# Altium schematic sheet 9) Connector.SchDoc
size 420 x 297 mm
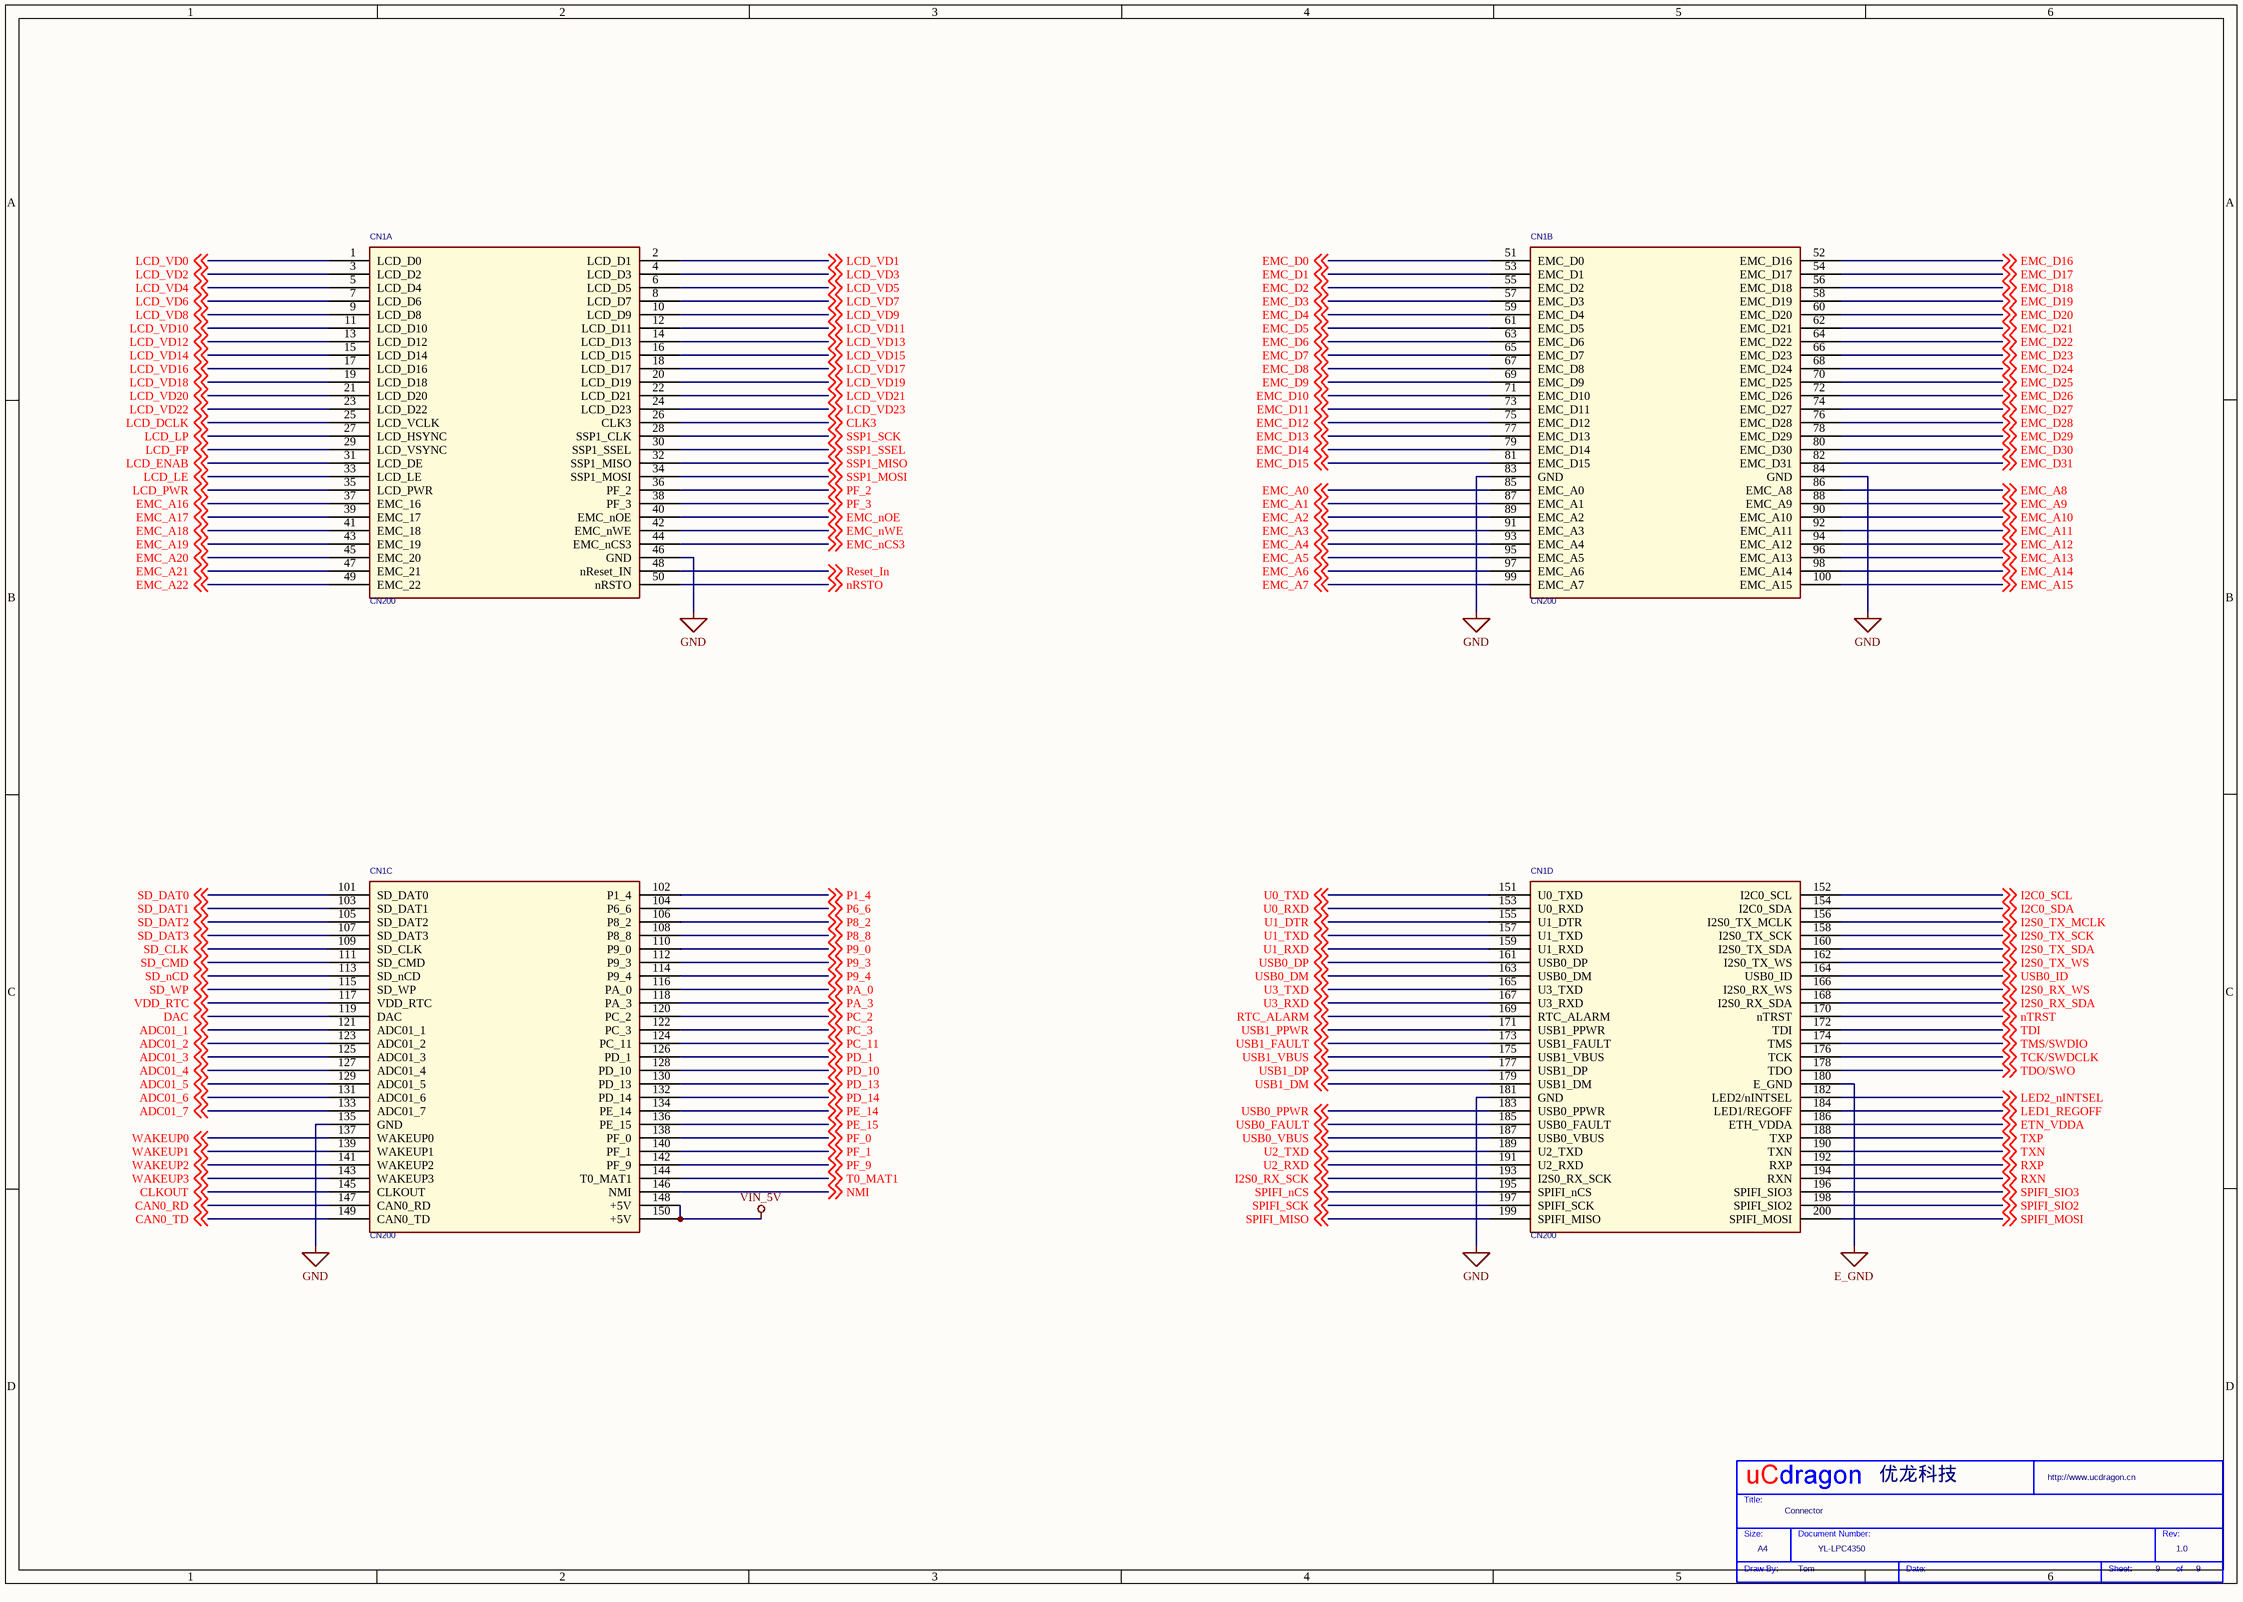
[diagram p0: 9) Connector.SchDoc]

## Parts
*  Company: 优龙科技  Drawing: Tom  Doc: YL-LPC4350  RevCode: 1.0  Title: Connector  Page Size: A4  Page Number: 9  (hidden comment: My Title 0)  (graphical)
CN1  CN200  [DIP-4X50PIN]  (parts A,B,C,D of 4)

## Nets
E_GND: CN1.180(E_GND)
GND: CN1.46(GND) CN1.83(GND) CN1.84(GND) CN1.135(GND) CN1.181(GND)
VIN_5V: CN1.148(+5V) CN1.150(+5V)
ADC01_1: CN1.121(ADC01_1) ; off-sheet ADC01_1
ADC01_2: CN1.123(ADC01_2) ; off-sheet ADC01_2
ADC01_3: CN1.125(ADC01_3) ; off-sheet ADC01_3
ADC01_4: CN1.127(ADC01_4) ; off-sheet ADC01_4
ADC01_5: CN1.129(ADC01_5) ; off-sheet ADC01_5
ADC01_6: CN1.131(ADC01_6) ; off-sheet ADC01_6
ADC01_7: CN1.133(ADC01_7) ; off-sheet ADC01_7
CAN0_RD: CN1.147(CAN0_RD) ; off-sheet CAN0_RD
CAN0_TD: CN1.149(CAN0_TD) ; off-sheet CAN0_TD
CLK3: CN1.26(CLK3) ; off-sheet CLK3
CLKOUT: CN1.145(CLKOUT) ; off-sheet CLKOUT
DAC: CN1.119(DAC) ; off-sheet DAC
EMC_A0: CN1.85(EMC_A0) ; off-sheet EMC_A0
EMC_A1: CN1.87(EMC_A1) ; off-sheet EMC_A1
EMC_A2: CN1.89(EMC_A2) ; off-sheet EMC_A2
EMC_A3: CN1.91(EMC_A3) ; off-sheet EMC_A3
EMC_A4: CN1.93(EMC_A4) ; off-sheet EMC_A4
EMC_A5: CN1.95(EMC_A5) ; off-sheet EMC_A5
EMC_A6: CN1.97(EMC_A6) ; off-sheet EMC_A6
EMC_A7: CN1.99(EMC_A7) ; off-sheet EMC_A7
EMC_A8: CN1.86(EMC_A8) ; off-sheet EMC_A8
EMC_A9: CN1.88(EMC_A9) ; off-sheet EMC_A9
EMC_A10: CN1.90(EMC_A10) ; off-sheet EMC_A10
EMC_A11: CN1.92(EMC_A11) ; off-sheet EMC_A11
EMC_A12: CN1.94(EMC_A12) ; off-sheet EMC_A12
EMC_A13: CN1.96(EMC_A13) ; off-sheet EMC_A13
EMC_A14: CN1.98(EMC_A14) ; off-sheet EMC_A14
EMC_A15: CN1.100(EMC_A15) ; off-sheet EMC_A15
EMC_A16: CN1.37(EMC_16) ; off-sheet EMC_A16
EMC_A17: CN1.39(EMC_17) ; off-sheet EMC_A17
EMC_A18: CN1.41(EMC_18) ; off-sheet EMC_A18
EMC_A19: CN1.43(EMC_19) ; off-sheet EMC_A19
EMC_A20: CN1.45(EMC_20) ; off-sheet EMC_A20
EMC_A21: CN1.47(EMC_21) ; off-sheet EMC_A21
EMC_A22: CN1.49(EMC_22) ; off-sheet EMC_A22
EMC_D0: CN1.51(EMC_D0) ; off-sheet EMC_D0
EMC_D1: CN1.53(EMC_D1) ; off-sheet EMC_D1
EMC_D2: CN1.55(EMC_D2) ; off-sheet EMC_D2
EMC_D3: CN1.57(EMC_D3) ; off-sheet EMC_D3
EMC_D4: CN1.59(EMC_D4) ; off-sheet EMC_D4
EMC_D5: CN1.61(EMC_D5) ; off-sheet EMC_D5
EMC_D6: CN1.63(EMC_D6) ; off-sheet EMC_D6
EMC_D7: CN1.65(EMC_D7) ; off-sheet EMC_D7
EMC_D8: CN1.67(EMC_D8) ; off-sheet EMC_D8
EMC_D9: CN1.69(EMC_D9) ; off-sheet EMC_D9
EMC_D10: CN1.71(EMC_D10) ; off-sheet EMC_D10
EMC_D11: CN1.73(EMC_D11) ; off-sheet EMC_D11
EMC_D12: CN1.75(EMC_D12) ; off-sheet EMC_D12
EMC_D13: CN1.77(EMC_D13) ; off-sheet EMC_D13
EMC_D14: CN1.79(EMC_D14) ; off-sheet EMC_D14
EMC_D15: CN1.81(EMC_D15) ; off-sheet EMC_D15
EMC_D16: CN1.52(EMC_D16) ; off-sheet EMC_D16
EMC_D17: CN1.54(EMC_D17) ; off-sheet EMC_D17
EMC_D18: CN1.56(EMC_D18) ; off-sheet EMC_D18
EMC_D19: CN1.58(EMC_D19) ; off-sheet EMC_D19
EMC_D20: CN1.60(EMC_D20) ; off-sheet EMC_D20
EMC_D21: CN1.62(EMC_D21) ; off-sheet EMC_D21
EMC_D22: CN1.64(EMC_D22) ; off-sheet EMC_D22
EMC_D23: CN1.66(EMC_D23) ; off-sheet EMC_D23
EMC_D24: CN1.68(EMC_D24) ; off-sheet EMC_D24
EMC_D25: CN1.70(EMC_D25) ; off-sheet EMC_D25
EMC_D26: CN1.72(EMC_D26) ; off-sheet EMC_D26
EMC_D27: CN1.74(EMC_D27) ; off-sheet EMC_D27
EMC_D28: CN1.76(EMC_D28) ; off-sheet EMC_D28
EMC_D29: CN1.78(EMC_D29) ; off-sheet EMC_D29
EMC_D30: CN1.80(EMC_D30) ; off-sheet EMC_D30
EMC_D31: CN1.82(EMC_D31) ; off-sheet EMC_D31
EMC_nCS3: CN1.44(EMC_nCS3) ; off-sheet EMC_nCS3
EMC_nOE: CN1.40(EMC_nOE) ; off-sheet EMC_nOE
EMC_nWE: CN1.42(EMC_nWE) ; off-sheet EMC_nWE
ETN_VDDA: CN1.186(ETH_VDDA) ; off-sheet ETN_VDDA
I2C0_SCL: CN1.152(I2C0_SCL) ; off-sheet I2C0_SCL
I2C0_SDA: CN1.154(I2C0_SDA) ; off-sheet I2C0_SDA
I2S0_RX_SCK: CN1.193(I2S0_RX_SCK) ; off-sheet I2S0_RX_SCK
I2S0_RX_SDA: CN1.168(I2S0_RX_SDA) ; off-sheet I2S0_RX_SDA
I2S0_RX_WS: CN1.166(I2S0_RX_WS) ; off-sheet I2S0_RX_WS
I2S0_TX_MCLK: CN1.156(I2S0_TX_MCLK) ; off-sheet I2S0_TX_MCLK
I2S0_TX_SCK: CN1.158(I2S0_TX_SCK) ; off-sheet I2S0_TX_SCK
I2S0_TX_SDA: CN1.160(I2S0_TX_SDA) ; off-sheet I2S0_TX_SDA
I2S0_TX_WS: CN1.162(I2S0_TX_WS) ; off-sheet I2S0_TX_WS
LCD_DCLK: CN1.25(LCD_VCLK) ; off-sheet LCD_DCLK
LCD_ENAB: CN1.31(LCD_DE) ; off-sheet LCD_ENAB
LCD_FP: CN1.29(LCD_VSYNC) ; off-sheet LCD_FP
LCD_LE: CN1.33(LCD_LE) ; off-sheet LCD_LE
LCD_LP: CN1.27(LCD_HSYNC) ; off-sheet LCD_LP
LCD_PWR: CN1.35(LCD_PWR) ; off-sheet LCD_PWR
LCD_VD0: CN1.1(LCD_D0) ; off-sheet LCD_VD0
LCD_VD1: CN1.2(LCD_D1) ; off-sheet LCD_VD1
LCD_VD2: CN1.3(LCD_D2) ; off-sheet LCD_VD2
LCD_VD3: CN1.4(LCD_D3) ; off-sheet LCD_VD3
LCD_VD4: CN1.5(LCD_D4) ; off-sheet LCD_VD4
LCD_VD5: CN1.6(LCD_D5) ; off-sheet LCD_VD5
LCD_VD6: CN1.7(LCD_D6) ; off-sheet LCD_VD6
LCD_VD7: CN1.8(LCD_D7) ; off-sheet LCD_VD7
LCD_VD8: CN1.9(LCD_D8) ; off-sheet LCD_VD8
LCD_VD9: CN1.10(LCD_D9) ; off-sheet LCD_VD9
LCD_VD10: CN1.11(LCD_D10) ; off-sheet LCD_VD10
LCD_VD11: CN1.12(LCD_D11) ; off-sheet LCD_VD11
LCD_VD12: CN1.13(LCD_D12) ; off-sheet LCD_VD12
LCD_VD13: CN1.14(LCD_D13) ; off-sheet LCD_VD13
LCD_VD14: CN1.15(LCD_D14) ; off-sheet LCD_VD14
LCD_VD15: CN1.16(LCD_D15) ; off-sheet LCD_VD15
LCD_VD16: CN1.17(LCD_D16) ; off-sheet LCD_VD16
LCD_VD17: CN1.18(LCD_D17) ; off-sheet LCD_VD17
LCD_VD18: CN1.19(LCD_D18) ; off-sheet LCD_VD18
LCD_VD19: CN1.20(LCD_D19) ; off-sheet LCD_VD19
LCD_VD20: CN1.21(LCD_D20) ; off-sheet LCD_VD20
LCD_VD21: CN1.22(LCD_D21) ; off-sheet LCD_VD21
LCD_VD22: CN1.23(LCD_D22) ; off-sheet LCD_VD22
LCD_VD23: CN1.24(LCD_D23) ; off-sheet LCD_VD23
LED1_REGOFF: CN1.184(LED1/REGOFF) ; off-sheet LED1_REGOFF
LED2_nINTSEL: CN1.182(LED2/nINTSEL) ; off-sheet LED2_nINTSEL
NMI: CN1.146(NMI) ; off-sheet NMI
nRSTO: CN1.50(nRSTO) ; off-sheet nRSTO
nTRST: CN1.170(nTRST) ; off-sheet nTRST
P1_4: CN1.102(P1_4) ; off-sheet P1_4
P6_6: CN1.104(P6_6) ; off-sheet P6_6
P8_2: CN1.106(P8_2) ; off-sheet P8_2
P8_8: CN1.108(P8_8) ; off-sheet P8_8
P9_0: CN1.110(P9_0) ; off-sheet P9_0
P9_3: CN1.112(P9_3) ; off-sheet P9_3
P9_4: CN1.114(P9_4) ; off-sheet P9_4
PA_0: CN1.116(PA_0) ; off-sheet PA_0
PA_3: CN1.118(PA_3) ; off-sheet PA_3
PC_2: CN1.120(PC_2) ; off-sheet PC_2
PC_3: CN1.122(PC_3) ; off-sheet PC_3
PC_11: CN1.124(PC_11) ; off-sheet PC_11
PD_1: CN1.126(PD_1) ; off-sheet PD_1
PD_10: CN1.128(PD_10) ; off-sheet PD_10
PD_13: CN1.130(PD_13) ; off-sheet PD_13
PD_14: CN1.132(PD_14) ; off-sheet PD_14
PE_14: CN1.134(PE_14) ; off-sheet PE_14
PE_15: CN1.136(PE_15) ; off-sheet PE_15
PF_0: CN1.138(PF_0) ; off-sheet PF_0
PF_1: CN1.140(PF_1) ; off-sheet PF_1
PF_2: CN1.36(PF_2) ; off-sheet PF_2
PF_3: CN1.38(PF_3) ; off-sheet PF_3
PF_9: CN1.142(PF_9) ; off-sheet PF_9
Reset_In: CN1.48(nReset_IN) ; off-sheet Reset_In
RTC_ALARM: CN1.169(RTC_ALARM) ; off-sheet RTC_ALARM
RXN: CN1.194(RXN) ; off-sheet RXN
RXP: CN1.192(RXP) ; off-sheet RXP
SD_CLK: CN1.109(SD_CLK) ; off-sheet SD_CLK
SD_CMD: CN1.111(SD_CMD) ; off-sheet SD_CMD
SD_DAT0: CN1.101(SD_DAT0) ; off-sheet SD_DAT0
SD_DAT1: CN1.103(SD_DAT1) ; off-sheet SD_DAT1
SD_DAT2: CN1.105(SD_DAT2) ; off-sheet SD_DAT2
SD_DAT3: CN1.107(SD_DAT3) ; off-sheet SD_DAT3
SD_nCD: CN1.113(SD_nCD) ; off-sheet SD_nCD
SD_WP: CN1.115(SD_WP) ; off-sheet SD_WP
SPIFI_MISO: CN1.199(SPIFI_MISO) ; off-sheet SPIFI_MISO
SPIFI_MOSI: CN1.200(SPIFI_MOSI) ; off-sheet SPIFI_MOSI
SPIFI_nCS: CN1.195(SPIFI_nCS) ; off-sheet SPIFI_nCS
SPIFI_SCK: CN1.197(SPIFI_SCK) ; off-sheet SPIFI_SCK
SPIFI_SIO2: CN1.198(SPIFI_SIO2) ; off-sheet SPIFI_SIO2
SPIFI_SIO3: CN1.196(SPIFI_SIO3) ; off-sheet SPIFI_SIO3
SSP1_MISO: CN1.32(SSP1_MISO) ; off-sheet SSP1_MISO
SSP1_MOSI: CN1.34(SSP1_MOSI) ; off-sheet SSP1_MOSI
SSP1_SCK: CN1.28(SSP1_CLK) ; off-sheet SSP1_SCK
SSP1_SSEL: CN1.30(SSP1_SSEL) ; off-sheet SSP1_SSEL
T0_MAT1: CN1.144(T0_MAT1) ; off-sheet T0_MAT1
TCK/SWDCLK: CN1.176(TCK) ; off-sheet TCK/SWDCLK
TDI: CN1.172(TDI) ; off-sheet TDI
TDO/SWO: CN1.178(TDO) ; off-sheet TDO/SWO
TMS/SWDIO: CN1.174(TMS) ; off-sheet TMS/SWDIO
TXN: CN1.190(TXN) ; off-sheet TXN
TXP: CN1.188(TXP) ; off-sheet TXP
U0_RXD: CN1.153(U0_RXD) ; off-sheet U0_RXD
U0_TXD: CN1.151(U0_TXD) ; off-sheet U0_TXD
U1_DTR: CN1.155(U1_DTR) ; off-sheet U1_DTR
U1_RXD: CN1.159(U1_RXD) ; off-sheet U1_RXD
U1_TXD: CN1.157(U1_TXD) ; off-sheet U1_TXD
U2_RXD: CN1.191(U2_RXD) ; off-sheet U2_RXD
U2_TXD: CN1.189(U2_TXD) ; off-sheet U2_TXD
U3_RXD: CN1.167(U3_RXD) ; off-sheet U3_RXD
U3_TXD: CN1.165(U3_TXD) ; off-sheet U3_TXD
USB0_DM: CN1.163(USB0_DM) ; off-sheet USB0_DM
USB0_DP: CN1.161(USB0_DP) ; off-sheet USB0_DP
USB0_FAULT: CN1.185(USB0_FAULT) ; off-sheet USB0_FAULT
USB0_ID: CN1.164(USB0_ID) ; off-sheet USB0_ID
USB0_PPWR: CN1.183(USB0_PPWR) ; off-sheet USB0_PPWR
USB0_VBUS: CN1.187(USB0_VBUS) ; off-sheet USB0_VBUS
USB1_DM: CN1.179(USB1_DM) ; off-sheet USB1_DM
USB1_DP: CN1.177(USB1_DP) ; off-sheet USB1_DP
USB1_FAULT: CN1.173(USB1_FAULT) ; off-sheet USB1_FAULT
USB1_PPWR: CN1.171(USB1_PPWR) ; off-sheet USB1_PPWR
USB1_VBUS: CN1.175(USB1_VBUS) ; off-sheet USB1_VBUS
VDD_RTC: CN1.117(VDD_RTC) ; off-sheet VDD_RTC
WAKEUP0: CN1.137(WAKEUP0) ; off-sheet WAKEUP0
WAKEUP1: CN1.139(WAKEUP1) ; off-sheet WAKEUP1
WAKEUP2: CN1.141(WAKEUP2) ; off-sheet WAKEUP2
WAKEUP3: CN1.143(WAKEUP3) ; off-sheet WAKEUP3

## Notes on the sheet
- (in symbol My Title 0) Title:; Size:; Document Number:; Rev:; Draw By:; Date:; Sheet:; of

## Library data of the parts
* = My Title 0: WebSite: http://www.ucdragon.cn; Page Create Date: May 29, 2006; Page Count: 9